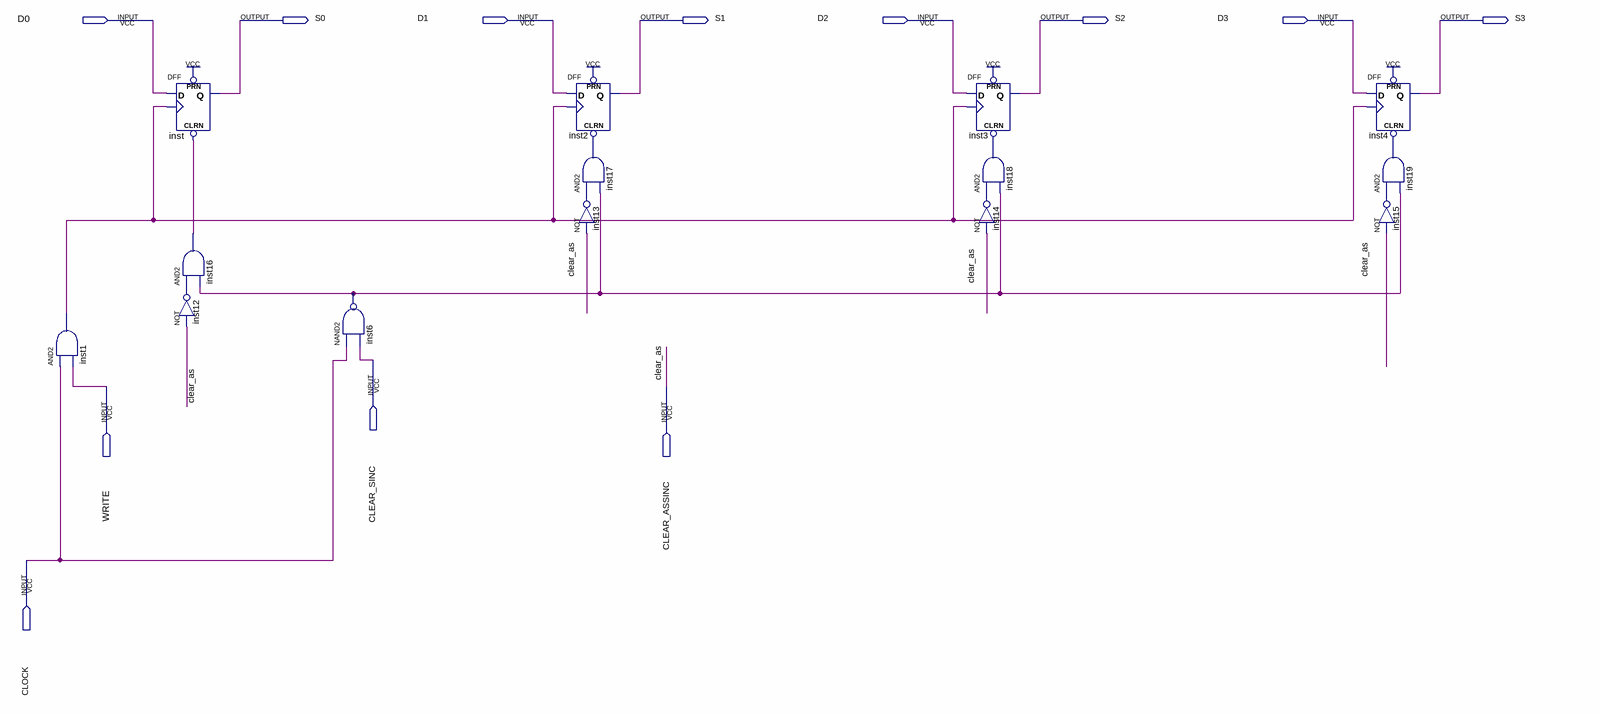
[diagram p0: schematic sheet]
// Quartus schematic Reg4Bits.bdf as structural Verilog: 14 symbols, 12 pins
module Reg4Bits (
  input  D0,
  input  D1,
  input  D2,
  input  D3,
  input  CLEAR_SINC,
  input  WRITE,
  input  CLEAR_ASSINC,
  input  CLOCK,
  output S0,
  output S1,
  output S2,
  output S3
);

  wire inst1_out, inst6_out, inst12_out, inst13_out, inst14_out, inst15_out, inst16_out, inst17_out,
       inst18_out, inst19_out;

  and inst1 (inst1_out, CLOCK, WRITE);
  DFF inst (.CLRN(inst16_out), .CLK(inst1_out), .D(D0), .PRN(1'b1), .Q(S0));
  and inst16 (inst16_out, inst12_out, inst6_out);
  not inst12 (inst12_out, CLEAR_ASSINC);
  nand inst6 (inst6_out, CLOCK, CLEAR_SINC);
  DFF inst2 (.CLRN(inst17_out), .CLK(inst1_out), .D(D1), .PRN(1'b1), .Q(S1));
  and inst17 (inst17_out, inst13_out, inst6_out);
  not inst13 (inst13_out, CLEAR_ASSINC);
  DFF inst3 (.CLRN(inst18_out), .CLK(inst1_out), .D(D2), .PRN(1'b1), .Q(S2));
  and inst18 (inst18_out, inst14_out, inst6_out);
  not inst14 (inst14_out, CLEAR_ASSINC);
  DFF inst4 (.CLRN(inst19_out), .CLK(inst1_out), .D(D3), .PRN(1'b1), .Q(S3));
  and inst19 (inst19_out, inst15_out, inst6_out);
  not inst15 (inst15_out, CLEAR_ASSINC);

  // Other names for the same wires on the sheet: clear_as = CLEAR_ASSINC
endmodule
